# EAGLE schematic Fathom-E (EAGLE 7.4.0)
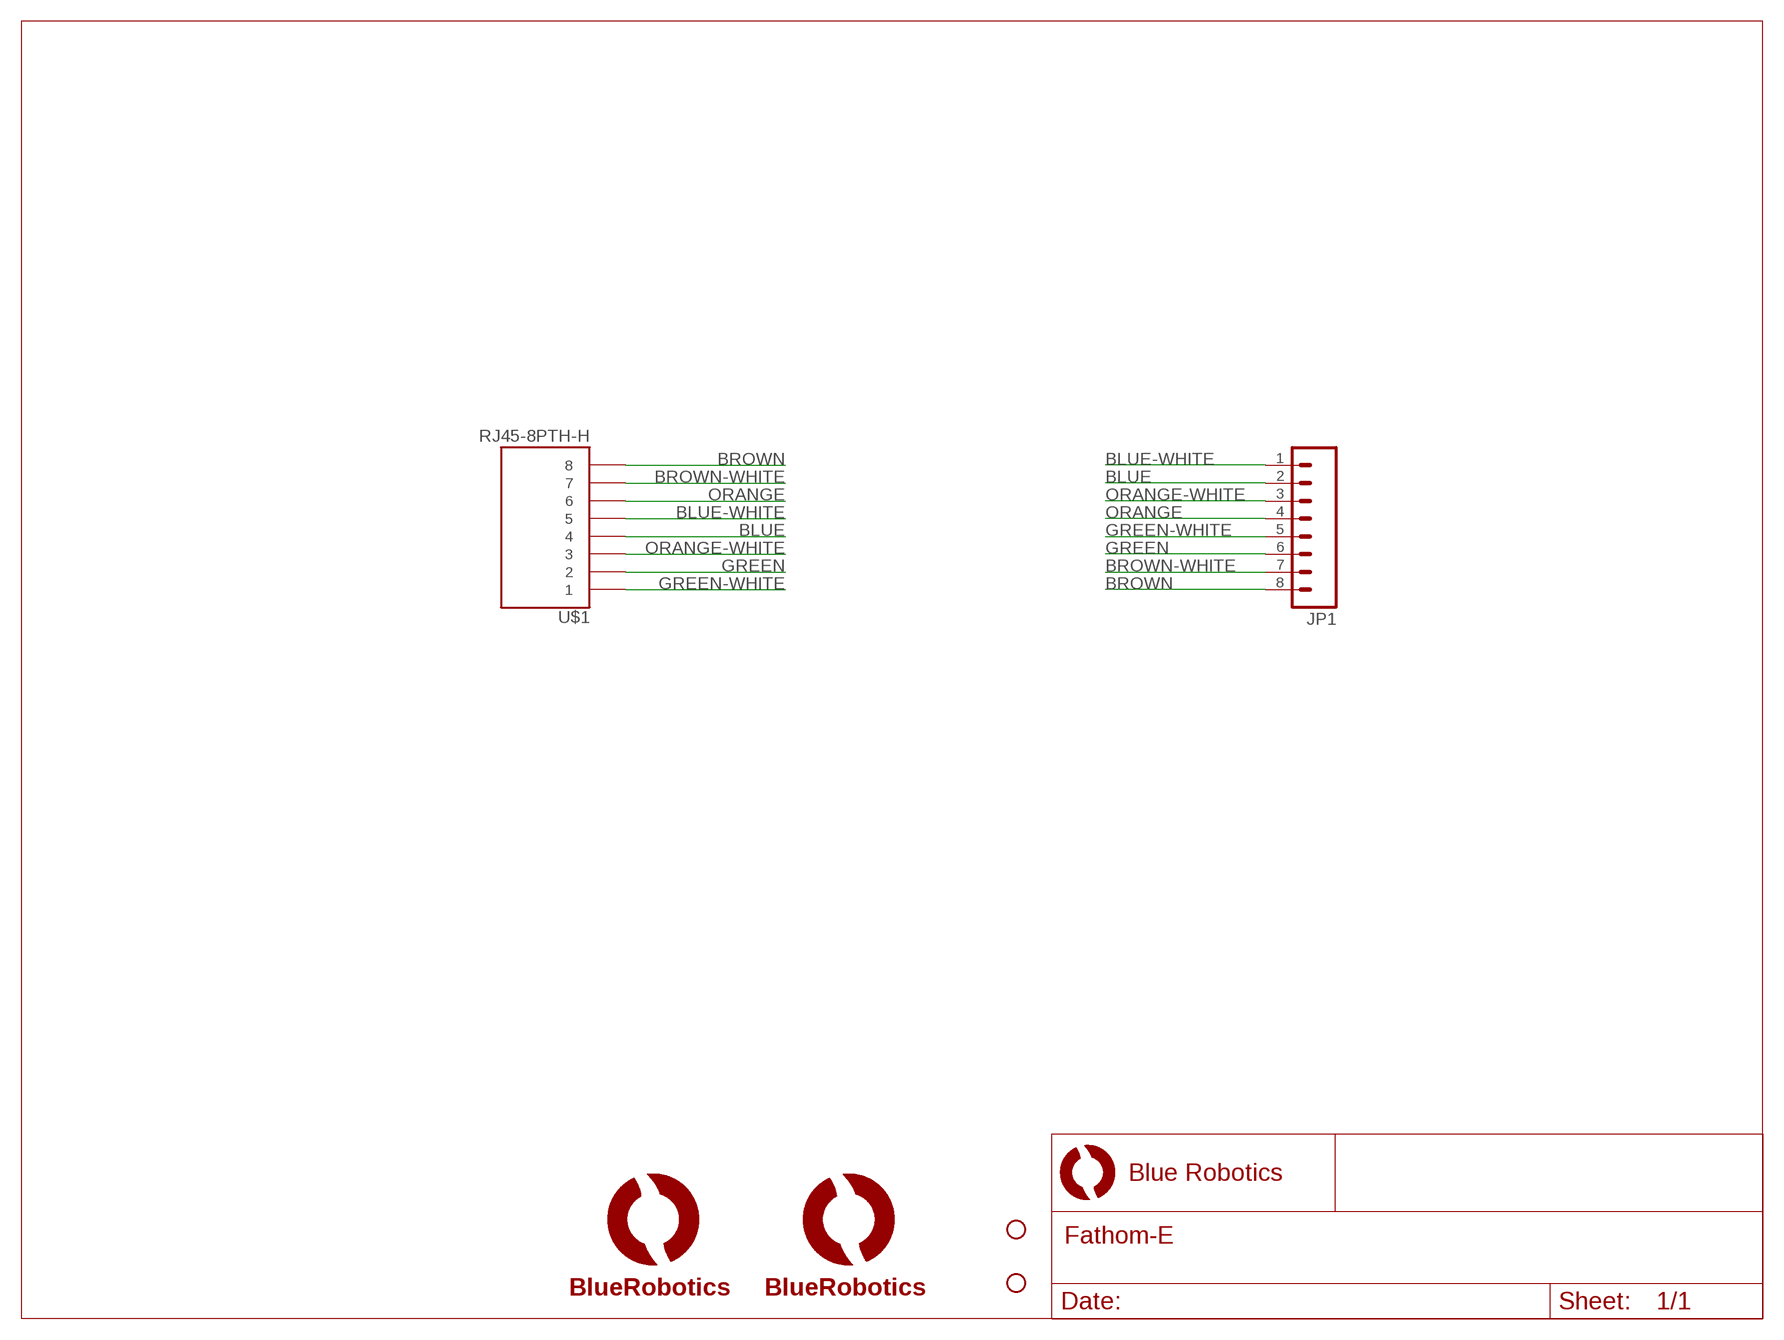
[diagram p0: schematic, sheet 1]

## Parts
JP1  M083.5MM-8  [SCREWTERMINAL-3.5MM-8]
STANDOFF2  STAND-OFF  [STAND-OFF]
STANDOFF3  STAND-OFF  [STAND-OFF]
U$1  RJ45-8PTH-H  [RJ45-8]
U$6  LOGOBR-LOGO-MS-COPPER  [BR-LOGO-MEDIUM-SMALL-COPPER]
U$7  LOGOFULL-M  [BR-FULL-LOGO-MEDIUM]

## Nets
BLUE: JP1.2 U$1.4
BLUE-WHITE: JP1.1 U$1.5
BROWN: JP1.8 U$1.8
BROWN-WHITE: JP1.7 U$1.7
GREEN: JP1.6 U$1.2
GREEN-WHITE: JP1.5 U$1.1
ORANGE: JP1.4 U$1.6
ORANGE-WHITE: JP1.3 U$1.3

## Library data of the parts
JP1 = SparkFun-Connectors:M08: Header 8 Standard 8-pin 0.1" header. Use with straight break away headers (SKU : PRT-00116), right angle break away headers (PRT-00553), swiss pins (PRT-00743), machine pins (PRT-00117), and female headers (PRT-00115).
STANDOFF2 STANDOFF3 = SparkFun-Electromechanical:STAND-OFF: #4 Stand Off This is the mechanical footprint for a #4 phillips button head screw. Use the keepout ring to avoid running the screw head into surrounding components. SKU : PRT-00447
U$1 = BlueRobotics-Main:RJ45-8: RJ45 Jack
U$6 U$7 = BlueRobotics-Main:LOGO